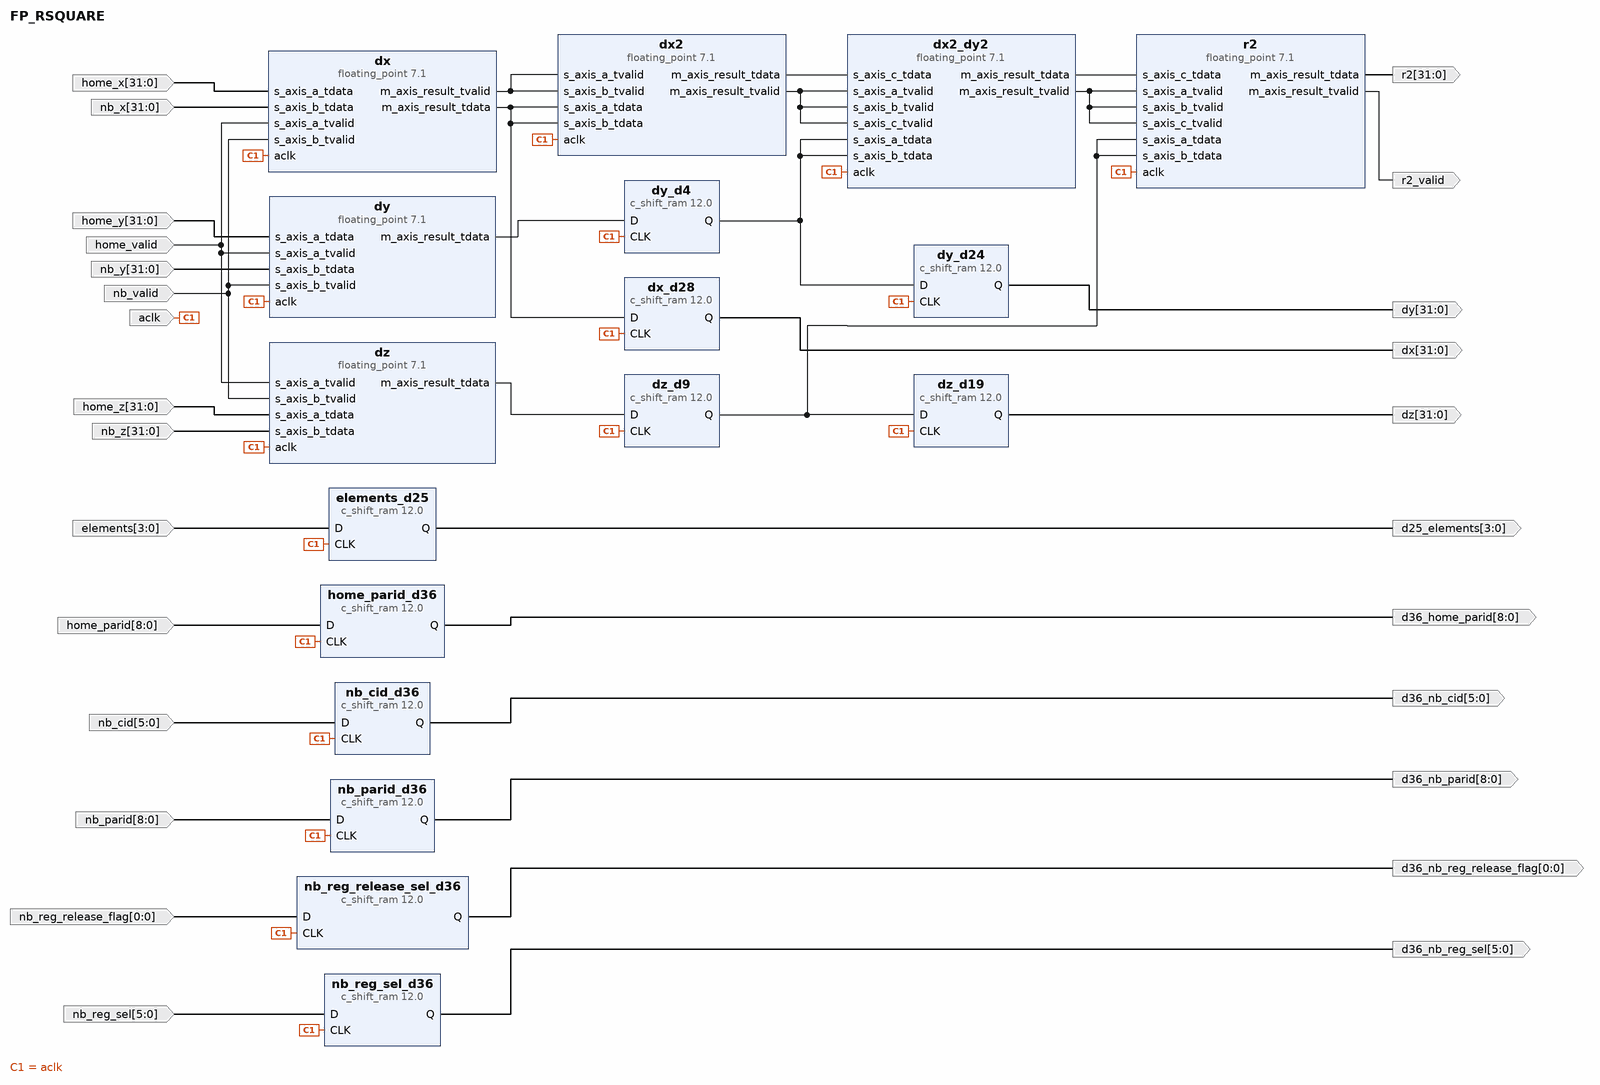
[diagram p0: block diagram of the top level]
# Vivado block design FP_RSQUARE, xcu280-fsvh2892-2L-e, Vivado 2021.2
create_bd_design FP_RSQUARE

create_bd_port -dir I -type clk aclk
set_property -dict {CONFIG.FREQ_HZ 10000000} [get_bd_ports aclk]
create_bd_port -dir O -from 3 -to 0 -type data d25_elements
create_bd_port -dir O -from 8 -to 0 -type data d36_home_parid
create_bd_port -dir O -from 5 -to 0 -type data d36_nb_cid
create_bd_port -dir O -from 8 -to 0 -type data d36_nb_parid
create_bd_port -dir O -from 0 -to 0 -type data d36_nb_reg_release_flag
create_bd_port -dir O -from 5 -to 0 -type data d36_nb_reg_sel
create_bd_port -dir O -from 31 -to 0 -type data dx
create_bd_port -dir O -from 31 -to 0 -type data dy
create_bd_port -dir O -from 31 -to 0 -type data dz
create_bd_port -dir I -from 3 -to 0 -type data elements
create_bd_port -dir I -from 8 -to 0 -type data home_parid
create_bd_port -dir I home_valid
create_bd_port -dir I -from 31 -to 0 home_x
create_bd_port -dir I -from 31 -to 0 home_y
create_bd_port -dir I -from 31 -to 0 home_z
create_bd_port -dir I -from 5 -to 0 -type data nb_cid
create_bd_port -dir I -from 8 -to 0 -type data nb_parid
create_bd_port -dir I -from 0 -to 0 -type data nb_reg_release_flag
create_bd_port -dir I -from 5 -to 0 -type data nb_reg_sel
create_bd_port -dir I nb_valid
create_bd_port -dir I -from 31 -to 0 nb_x
create_bd_port -dir I -from 31 -to 0 nb_y
create_bd_port -dir I -from 31 -to 0 nb_z
create_bd_port -dir O -from 31 -to 0 r2
create_bd_port -dir O r2_valid

create_bd_cell -type ip -vlnv xilinx.com:ip:floating_point:7.1 dx
set_property -dict [list \
  CONFIG.Add_Sub_Value Subtract \
  CONFIG.C_Latency 3 \
  CONFIG.C_Mult_Usage Full_Usage \
  CONFIG.C_Optimization Speed_Optimized \
  CONFIG.C_Rate 1 \
  CONFIG.Flow_Control NonBlocking \
  CONFIG.Has_RESULT_TREADY false \
  CONFIG.Maximum_Latency false \
] [get_bd_cells dx]
create_bd_cell -type ip -vlnv xilinx.com:ip:floating_point:7.1 dx2
set_property -dict [list \
  CONFIG.C_Latency 4 \
  CONFIG.C_Mult_Usage Full_Usage \
  CONFIG.C_Rate 1 \
  CONFIG.C_Result_Exponent_Width 8 \
  CONFIG.C_Result_Fraction_Width 24 \
  CONFIG.Flow_Control NonBlocking \
  CONFIG.Has_RESULT_TREADY false \
  CONFIG.Maximum_Latency false \
  CONFIG.Operation_Type Multiply \
  CONFIG.Result_Precision_Type Single \
] [get_bd_cells dx2]
create_bd_cell -type ip -vlnv xilinx.com:ip:floating_point:7.1 dx2_dy2
set_property -dict [list \
  CONFIG.Add_Sub_Value Add \
  CONFIG.C_Latency 5 \
  CONFIG.C_Mult_Usage Medium_Usage \
  CONFIG.C_Rate 1 \
  CONFIG.C_Result_Exponent_Width 8 \
  CONFIG.C_Result_Fraction_Width 24 \
  CONFIG.Flow_Control NonBlocking \
  CONFIG.Has_RESULT_TREADY false \
  CONFIG.Maximum_Latency false \
  CONFIG.Operation_Type FMA \
  CONFIG.Result_Precision_Type Single \
] [get_bd_cells dx2_dy2]
create_bd_cell -type ip -vlnv xilinx.com:ip:c_shift_ram:12.0 dx_d28
set_property -dict {CONFIG.Depth 28 CONFIG.Width 32} [get_bd_cells dx_d28]
create_bd_cell -type ip -vlnv xilinx.com:ip:floating_point:7.1 dy
set_property -dict [list \
  CONFIG.Add_Sub_Value Subtract \
  CONFIG.C_Latency 3 \
  CONFIG.C_Mult_Usage Full_Usage \
  CONFIG.C_Optimization Speed_Optimized \
  CONFIG.C_Rate 1 \
  CONFIG.Flow_Control NonBlocking \
  CONFIG.Has_RESULT_TREADY false \
  CONFIG.Maximum_Latency false \
] [get_bd_cells dy]
create_bd_cell -type ip -vlnv xilinx.com:ip:c_shift_ram:12.0 dy_d4
set_property -dict {CONFIG.Depth 4 CONFIG.Width 32} [get_bd_cells dy_d4]
create_bd_cell -type ip -vlnv xilinx.com:ip:c_shift_ram:12.0 dy_d24
set_property -dict {CONFIG.Depth 24 CONFIG.Width 32} [get_bd_cells dy_d24]
create_bd_cell -type ip -vlnv xilinx.com:ip:floating_point:7.1 dz
set_property -dict [list \
  CONFIG.Add_Sub_Value Subtract \
  CONFIG.C_Latency 3 \
  CONFIG.C_Mult_Usage Full_Usage \
  CONFIG.C_Optimization Speed_Optimized \
  CONFIG.C_Rate 1 \
  CONFIG.Flow_Control NonBlocking \
  CONFIG.Has_RESULT_TREADY false \
  CONFIG.Maximum_Latency false \
] [get_bd_cells dz]
create_bd_cell -type ip -vlnv xilinx.com:ip:c_shift_ram:12.0 dz_d9
set_property -dict {CONFIG.Depth 9 CONFIG.Width 32} [get_bd_cells dz_d9]
create_bd_cell -type ip -vlnv xilinx.com:ip:c_shift_ram:12.0 dz_d19
set_property -dict {CONFIG.Depth 19 CONFIG.Width 32} [get_bd_cells dz_d19]
create_bd_cell -type ip -vlnv xilinx.com:ip:c_shift_ram:12.0 elements_d25
set_property -dict {CONFIG.Depth 25 CONFIG.Width 4} [get_bd_cells elements_d25]
create_bd_cell -type ip -vlnv xilinx.com:ip:c_shift_ram:12.0 home_parid_d36
set_property -dict {CONFIG.Depth 36 CONFIG.Width 9} [get_bd_cells home_parid_d36]
create_bd_cell -type ip -vlnv xilinx.com:ip:c_shift_ram:12.0 nb_cid_d36
set_property -dict {CONFIG.Depth 36 CONFIG.Width 6} [get_bd_cells nb_cid_d36]
create_bd_cell -type ip -vlnv xilinx.com:ip:c_shift_ram:12.0 nb_parid_d36
set_property -dict {CONFIG.Depth 36 CONFIG.Width 9} [get_bd_cells nb_parid_d36]
create_bd_cell -type ip -vlnv xilinx.com:ip:c_shift_ram:12.0 nb_reg_release_sel_d36
set_property -dict {CONFIG.Depth 36 CONFIG.Width 1} [get_bd_cells nb_reg_release_sel_d36]
create_bd_cell -type ip -vlnv xilinx.com:ip:c_shift_ram:12.0 nb_reg_sel_d36
set_property -dict {CONFIG.Depth 36 CONFIG.Width 6} [get_bd_cells nb_reg_sel_d36]
create_bd_cell -type ip -vlnv xilinx.com:ip:floating_point:7.1 r2
set_property -dict [list \
  CONFIG.Add_Sub_Value Add \
  CONFIG.C_Latency 5 \
  CONFIG.C_Mult_Usage Medium_Usage \
  CONFIG.C_Rate 1 \
  CONFIG.C_Result_Exponent_Width 8 \
  CONFIG.C_Result_Fraction_Width 24 \
  CONFIG.Flow_Control NonBlocking \
  CONFIG.Has_RESULT_TREADY false \
  CONFIG.Maximum_Latency false \
  CONFIG.Operation_Type FMA \
  CONFIG.Result_Precision_Type Single \
] [get_bd_cells r2]

# ---- connections ----

connect_bd_net -net D_0_1 [get_bd_ports nb_parid] [get_bd_pins nb_parid_d36/D]
connect_bd_net -net D_0_2 [get_bd_ports elements] [get_bd_pins elements_d25/D]
connect_bd_net -net D_0_3 [get_bd_ports nb_cid] [get_bd_pins nb_cid_d36/D]
connect_bd_net -net D_0_4 [get_bd_ports nb_reg_sel] [get_bd_pins nb_reg_sel_d36/D]
connect_bd_net -net D_1_1 [get_bd_ports home_parid] [get_bd_pins home_parid_d36/D]
connect_bd_net -net D_1_2 [get_bd_ports nb_reg_release_flag] [get_bd_pins nb_reg_release_sel_d36/D]
connect_bd_net -net aclk_0_1 [get_bd_ports aclk] \
  [get_bd_pins dx/aclk] [get_bd_pins dx2/aclk] [get_bd_pins dx2_dy2/aclk] [get_bd_pins dx_d28/CLK] [get_bd_pins dy/aclk] \
  [get_bd_pins dy_d24/CLK] [get_bd_pins dy_d4/CLK] [get_bd_pins dz/aclk] [get_bd_pins dz_d19/CLK] [get_bd_pins dz_d9/CLK] \
  [get_bd_pins elements_d25/CLK] [get_bd_pins home_parid_d36/CLK] [get_bd_pins nb_cid_d36/CLK] [get_bd_pins nb_parid_d36/CLK] \
  [get_bd_pins nb_reg_release_sel_d36/CLK] [get_bd_pins nb_reg_sel_d36/CLK] [get_bd_pins r2/aclk]
connect_bd_net [get_bd_pins dx2_dy2/m_axis_result_tdata] [get_bd_pins r2/s_axis_c_tdata]
connect_bd_net [get_bd_pins dx2_dy2/m_axis_result_tvalid] \
  [get_bd_pins r2/s_axis_a_tvalid] [get_bd_pins r2/s_axis_b_tvalid] [get_bd_pins r2/s_axis_c_tvalid]
connect_bd_net [get_bd_pins dx2/m_axis_result_tdata] [get_bd_pins dx2_dy2/s_axis_c_tdata]
connect_bd_net [get_bd_pins dx2/m_axis_result_tvalid] \
  [get_bd_pins dx2_dy2/s_axis_a_tvalid] [get_bd_pins dx2_dy2/s_axis_b_tvalid] [get_bd_pins dx2_dy2/s_axis_c_tvalid]
connect_bd_net -net dx_d14_Q [get_bd_pins dx_d28/Q] [get_bd_ports dx]
connect_bd_net [get_bd_pins dx/m_axis_result_tdata] [get_bd_pins dx2/s_axis_a_tdata] [get_bd_pins dx2/s_axis_b_tdata] [get_bd_pins dx_d28/D]
connect_bd_net [get_bd_pins dx/m_axis_result_tvalid] [get_bd_pins dx2/s_axis_a_tvalid] [get_bd_pins dx2/s_axis_b_tvalid]
connect_bd_net -net dy_d10_Q [get_bd_pins dy_d24/Q] [get_bd_ports dy]
connect_bd_net [get_bd_pins dy_d4/Q] [get_bd_pins dx2_dy2/s_axis_a_tdata] [get_bd_pins dx2_dy2/s_axis_b_tdata] [get_bd_pins dy_d24/D]
connect_bd_net [get_bd_pins dy/m_axis_result_tdata] [get_bd_pins dy_d4/D]
connect_bd_net -net dz_d5_Q [get_bd_pins dz_d19/Q] [get_bd_ports dz]
connect_bd_net [get_bd_pins dz_d9/Q] [get_bd_pins dz_d19/D] [get_bd_pins r2/s_axis_a_tdata] [get_bd_pins r2/s_axis_b_tdata]
connect_bd_net [get_bd_pins dz/m_axis_result_tdata] [get_bd_pins dz_d9/D]
connect_bd_net -net elements_d18_Q [get_bd_pins elements_d25/Q] [get_bd_ports d25_elements]
connect_bd_net -net home_parid_d17_Q [get_bd_pins home_parid_d36/Q] [get_bd_ports d36_home_parid]
connect_bd_net -net home_parid_d18_Q [get_bd_pins nb_parid_d36/Q] [get_bd_ports d36_nb_parid]
connect_bd_net [get_bd_pins nb_cid_d36/Q] [get_bd_ports d36_nb_cid]
connect_bd_net [get_bd_pins nb_reg_release_sel_d36/Q] [get_bd_ports d36_nb_reg_release_flag]
connect_bd_net -net nb_reg_sel_d37_Q [get_bd_pins nb_reg_sel_d36/Q] [get_bd_ports d36_nb_reg_sel]
connect_bd_net [get_bd_pins r2/m_axis_result_tdata] [get_bd_ports r2]
connect_bd_net [get_bd_pins r2/m_axis_result_tvalid] [get_bd_ports r2_valid]
connect_bd_net -net s_axis_a_tdata_0_1 [get_bd_ports home_x] [get_bd_pins dx/s_axis_a_tdata]
connect_bd_net -net s_axis_a_tdata_0_2 [get_bd_ports home_y] [get_bd_pins dy/s_axis_a_tdata]
connect_bd_net -net s_axis_a_tdata_0_3 [get_bd_ports home_z] [get_bd_pins dz/s_axis_a_tdata]
connect_bd_net -net s_axis_a_tvalid_0_1 [get_bd_ports home_valid] \
  [get_bd_pins dx/s_axis_a_tvalid] [get_bd_pins dy/s_axis_a_tvalid] [get_bd_pins dz/s_axis_a_tvalid]
connect_bd_net -net s_axis_b_tdata_0_1 [get_bd_ports nb_x] [get_bd_pins dx/s_axis_b_tdata]
connect_bd_net -net s_axis_b_tdata_0_2 [get_bd_ports nb_y] [get_bd_pins dy/s_axis_b_tdata]
connect_bd_net -net s_axis_b_tdata_0_3 [get_bd_ports nb_z] [get_bd_pins dz/s_axis_b_tdata]
connect_bd_net -net s_axis_b_tvalid_0_1 [get_bd_ports nb_valid] \
  [get_bd_pins dx/s_axis_b_tvalid] [get_bd_pins dy/s_axis_b_tvalid] [get_bd_pins dz/s_axis_b_tvalid]

validate_bd_design
save_bd_design
